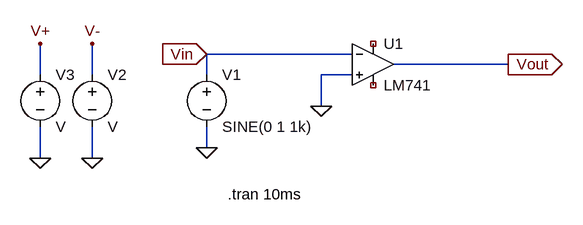
[diagram p0: schematic Open-Loop Op-Amp.asc]
Open-Loop Op-Amp.asc, the LTspice schematic file:
Version 4
SHEET 1 880 680
WIRE 384 256 160 256
WIRE 624 272 448 272
WIRE -96 288 -96 240
WIRE -16 288 -16 240
WIRE 160 288 160 256
WIRE 384 288 336 288
WIRE 336 336 336 288
WIRE 160 400 160 368
WIRE -96 416 -96 368
WIRE -16 416 -16 368
FLAG 160 400 0
FLAG 336 336 0
FLAG 624 272 Vout
IOPIN 624 272 Out
FLAG 160 256 Vin
IOPIN 160 256 In
FLAG -16 240 V-
FLAG -96 240 V+
FLAG -16 416 0
FLAG -96 416 0
SYMBOL OpAmps/LM741 416 208 R0
SYMATTR InstName U1
SYMBOL voltage 160 272 R0
SYMATTR InstName V1
SYMATTR Value SINE(0 1 1k)
SYMBOL voltage -16 272 R0
SYMATTR InstName V2
SYMBOL voltage -96 272 R0
SYMATTR InstName V3
TEXT 192 472 Left 2 !.tran 10ms

The netlist it stands for:
* Open-Loop Op-Amp.asc
XU1 0 Vin NC_01 NC_02 Vout LM741  ; pins In+ In- V+ V- OUT
V1 Vin 0 SINE(0 1 1k)
V2 V- 0 V
V3 V+ 0 V
.tran 10ms
.lib LM741.lib
.backanno
.end